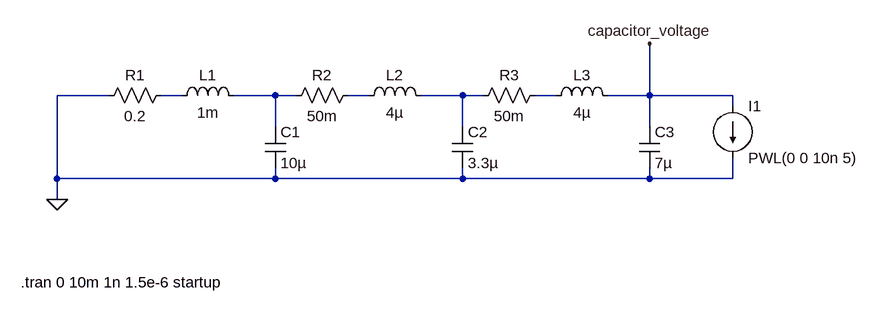
[diagram p0: schematic grid_inverter_transient.asc]
grid_inverter_transient.asc, the LTspice schematic file:
Version 4
SHEET 1 1256 680
WIRE -16 128 -96 128
WIRE 96 128 64 128
WIRE 240 128 176 128
WIRE 272 128 240 128
WIRE 384 128 352 128
WIRE 528 128 464 128
WIRE 560 128 528 128
WIRE 672 128 640 128
WIRE 816 128 816 48
WIRE 816 128 752 128
WIRE 944 128 816 128
WIRE 944 144 944 128
WIRE 240 176 240 128
WIRE 528 176 528 128
WIRE 816 176 816 128
WIRE -96 256 -96 128
WIRE 240 256 240 240
WIRE 240 256 -96 256
WIRE 528 256 528 240
WIRE 528 256 240 256
WIRE 816 256 816 240
WIRE 816 256 528 256
WIRE 944 256 944 224
WIRE 944 256 816 256
WIRE -96 288 -96 256
FLAG -96 288 0
FLAG 816 48 capacitor_voltage
SYMBOL ind 80 144 R270
WINDOW 0 32 56 VTop 2
WINDOW 3 5 56 VBottom 2
SYMATTR InstName L1
SYMATTR Value 1m
SYMBOL cap 224 176 R0
SYMATTR InstName C1
SYMATTR Value 10µ
SYMBOL res 80 112 R90
WINDOW 0 0 56 VBottom 2
WINDOW 3 32 56 VTop 2
SYMATTR InstName R1
SYMATTR Value 0.2
SYMBOL ind 368 144 R270
WINDOW 0 32 56 VTop 2
WINDOW 3 5 56 VBottom 2
SYMATTR InstName L2
SYMATTR Value 4µ
SYMBOL cap 512 176 R0
SYMATTR InstName C2
SYMATTR Value 3.3µ
SYMBOL res 368 112 R90
WINDOW 0 0 56 VBottom 2
WINDOW 3 32 56 VTop 2
SYMATTR InstName R2
SYMATTR Value 50m
SYMBOL ind 656 144 R270
WINDOW 0 32 56 VTop 2
WINDOW 3 5 56 VBottom 2
SYMATTR InstName L3
SYMATTR Value 4µ
SYMBOL cap 800 176 R0
SYMATTR InstName C3
SYMATTR Value 7µ
SYMBOL res 656 112 R90
WINDOW 0 0 56 VBottom 2
WINDOW 3 32 56 VTop 2
SYMATTR InstName R3
SYMATTR Value 50m
SYMBOL load2 944 144 R0
WINDOW 123 0 0 Left 0
WINDOW 39 0 0 Left 0
SYMATTR InstName I1
SYMATTR Value PWL(0 0 10n 5)
TEXT -152 416 Left 2 !.tran 0 10m 1n 1.5e-6 startup

The netlist it stands for:
* grid_inverter_transient.asc
L1 N001 N002 1m
C1 N002 0 10µ
R1 N001 0 0.2
L2 N003 N004 4µ
C2 N004 0 3.3µ
R2 N003 N002 50m
L3 N005 capacitor_voltage 4µ
C3 capacitor_voltage 0 7µ
R3 N005 N004 50m
I1 capacitor_voltage 0 PWL(0 0 10n 5)
.tran 0 10m 1n 1.5e-6 startup
.backanno
.end